# Altium schematic sheet Power.SchDoc
size A4
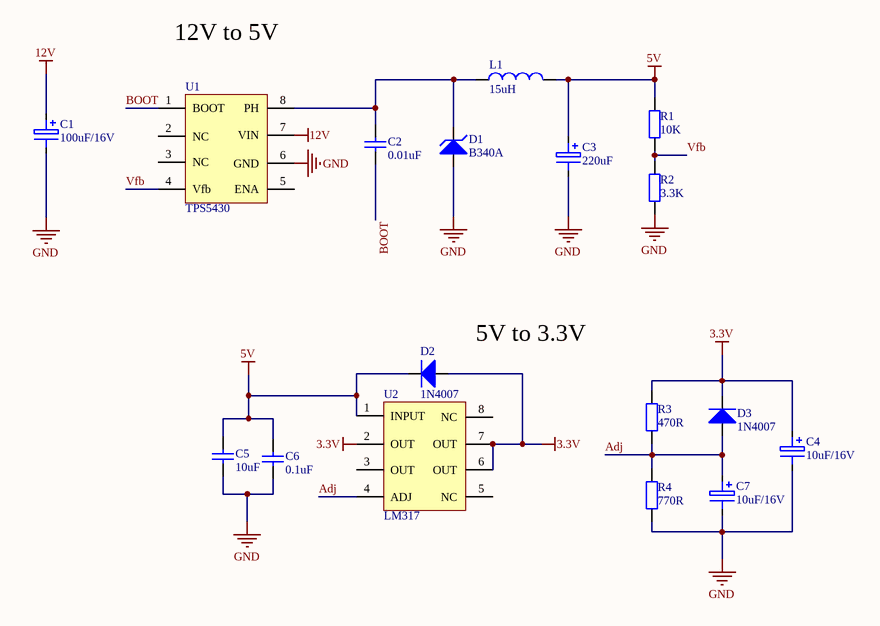
[diagram p0: Power.SchDoc]

## Parts
C1  100uF/16V  [CAPM-7.0*4.5]
C2  0.01uF  [0603]
C3  220uF  [CAPM-7.0*4.5]
C4  10uF/16V  [CAPM-5.5*3.3]
C5  10uF  [0603]
C6  0.1uF  [0603]
C7  10uF/16V  [CAPM-5.5*3.3]
D1  B340A  [DO214-AC]
D2  1N4007  [DO214-AC]
D3  1N4007  [DO214-AC]
L1  15uH  [7*7*4-15uH]
R1  10K  [0603]
R2  3.3K  [0603]
R3  470R  [0603]
R4  770R  [0603]
U1  TPS5430  [TPS5430]
U2  LM317  [LM317L]

## Nets
3.3V: C4.1 D2.1(A) D3.2(K) R3.2 U2.2(OUT) U2.6(OUT) U2.7(OUT)
5V: C3.1 C5.2 C6.2 D2.2(K) L1.2 R1.2 U2.1(INPUT)
12V: C1.1 U1.7(VIN)
GND: C1.2 C3.2 C4.2 C5.1 C6.1 C7.2 D1.1(A) R2.1 R4.1 U1.6(GND)
Adj: C7.1 D3.1(A) R3.1 R4.2 U2.4(ADJ)
BOOT: C2.1 U1.1(BOOT)
Vfb: R1.1 R2.2 U1.4(Vfb)
NetC2_2: C2.2 D1.2(K) L1.1 U1.8(PH)

Not connected (* = marked no-connect by the designer): U1 2(NC) 3(NC) 5(ENA); U2 3(OUT) 5(NC) 8(NC)

## Notes on the sheet
- 12V to 5V
- 5V to 3.3V

## Library data of the parts
C1 C3 C4 C7 = Cap3: aluminum
C2 C5 C6 = Cap1: ceramic
D1 = B340A-13-F
L1 = Inductor
R1-R4 = Res
U2 = LM317L